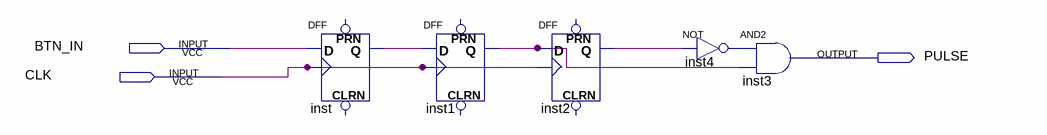
[diagram p0: schematic sheet]
// Quartus schematic EDGE_PULSE.bdf as structural Verilog: 5 symbols, 3 pins
module EDGE_PULSE (
  input  BTN_IN,
  input  CLK,
  output PULSE
);

  wire inst1_q, inst2_q, inst4_out, inst_q;

  DFF inst (.CLK(CLK), .D(BTN_IN), .Q(inst_q));  // open: CLRN, PRN
  DFF inst1 (.CLK(CLK), .D(inst_q), .Q(inst1_q));  // open: CLRN, PRN
  DFF inst2 (.CLK(CLK), .D(inst1_q), .Q(inst2_q));  // open: CLRN, PRN
  not inst4 (inst4_out, inst2_q);
  and inst3 (PULSE, inst4_out, inst1_q);
endmodule
